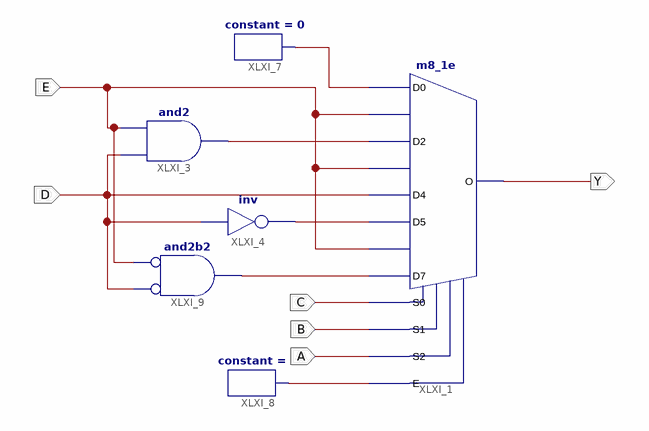
[diagram p0: schematic sheet 1]
// Xilinx ISE schematic funkcja2_m8_1e.sch (spartan3e) as structural Verilog: 6 symbols, 6 ports
module funkcja2_m8_1e (
  input  A,
  input  B,
  input  C,
  input  E,
  input  D,
  output Y
);

  wire XLXN_39, XLXN_46, XLXN_47, XLXN_48, XLXN_49;

  m8_1e XLXI_1 (
    .D0(XLXN_48), .D1(E), .D2(XLXN_46), .D3(E), .D4(D), .D5(XLXN_39), .D6(E), .D7(XLXN_47), .E(XLXN_49),
    .S0(C), .S1(B), .S2(A), .O(Y));
  not XLXI_4 (XLXN_39, D);
  and XLXI_3 (XLXN_46, D, E);
  constant #(.CValue("0")) XLXI_7 (.O(XLXN_48));
  constant #(.CValue("1")) XLXI_8 (.O(XLXN_49));
  and XLXI_9 (XLXN_47, ~D, ~E);  // and2b2
endmodule
